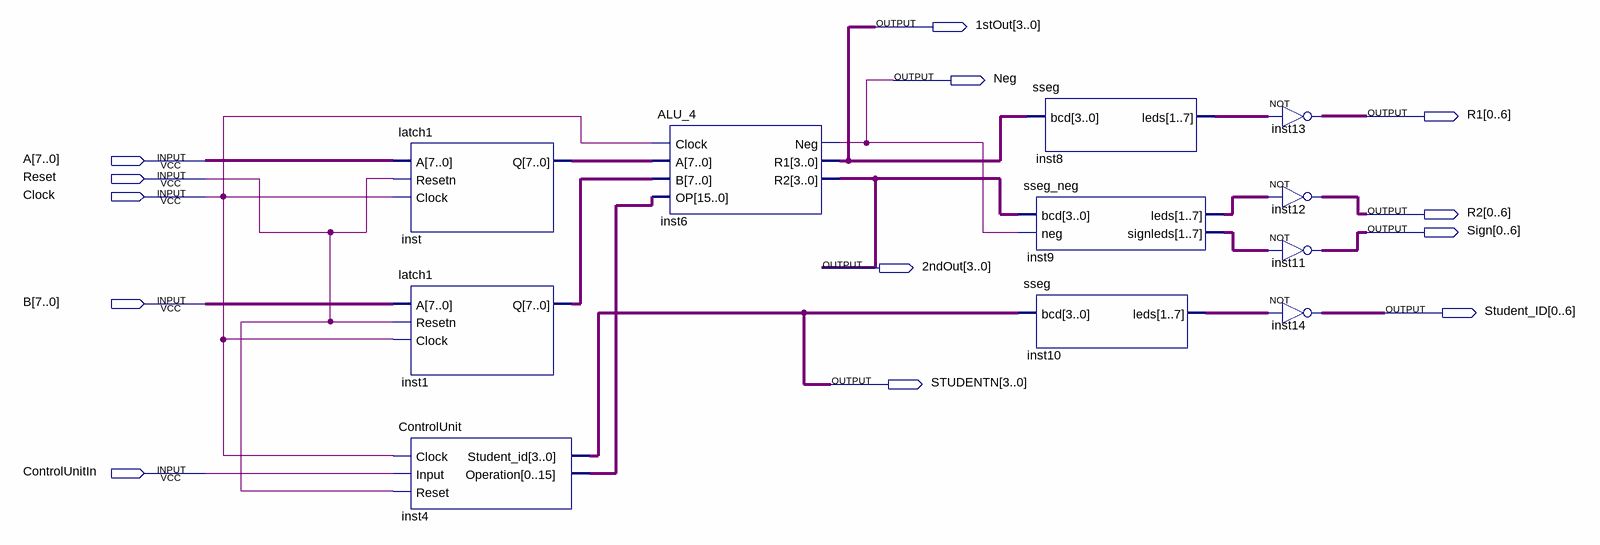
[diagram p0: schematic sheet]
// Quartus schematic FinalDesign.bdf as structural Verilog: 11 symbols, 13 pins
module FinalDesign (
  input  [7:0] A,
  input  Reset,
  input  Clock,
  input  [7:0] B,
  input  ControlUnitIn,
  output [3:0] \1stOut ,
  output Neg,
  output [0:6] R1,
  output [0:6] R2,
  output [0:6] Sign,
  output [3:0] \2ndOut ,
  output [0:6] Student_ID,
  output [3:0] STUDENTN
);

  wire [6:0] inst8_leds, inst9_leds, inst9_signleds, inst10_leds;
  wire [7:0] inst1_q, inst_q;
  wire [15:0] inst4_operation;

  latch1 inst (.A(A), .Resetn(Reset), .Clock(Clock), .Q(inst_q));
  latch1 inst1 (.A(B), .Resetn(Reset), .Clock(Clock), .Q(inst1_q));
  ControlUnit inst4 (
    .Clock(Clock), .Input(ControlUnitIn), .Reset(Reset), .Student_id(STUDENTN), .Operation(inst4_operation));
  ALU_4 inst6 (.Clock(Clock), .A(inst_q), .B(inst1_q), .OP(inst4_operation), .Neg(Neg), .R1(\1stOut ), .R2(\2ndOut ));
  sseg inst8 (.bcd(\1stOut ), .leds(inst8_leds));
  sseg_neg inst9 (.bcd(\2ndOut ), .neg(Neg), .leds(inst9_leds), .signleds(inst9_signleds));
  sseg inst10 (.bcd(STUDENTN), .leds(inst10_leds));
  assign R1 = ~inst8_leds;  // NOT inst13, 7 bits wide
  assign R2 = ~inst9_leds;  // NOT inst12, 7 bits wide
  assign Sign = ~inst9_signleds;  // NOT inst11, 7 bits wide
  assign Student_ID = ~inst10_leds;  // NOT inst14, 7 bits wide
endmodule
